# Altium schematic sheet Sch_mcu_brd_mcu.SchDoc
size A
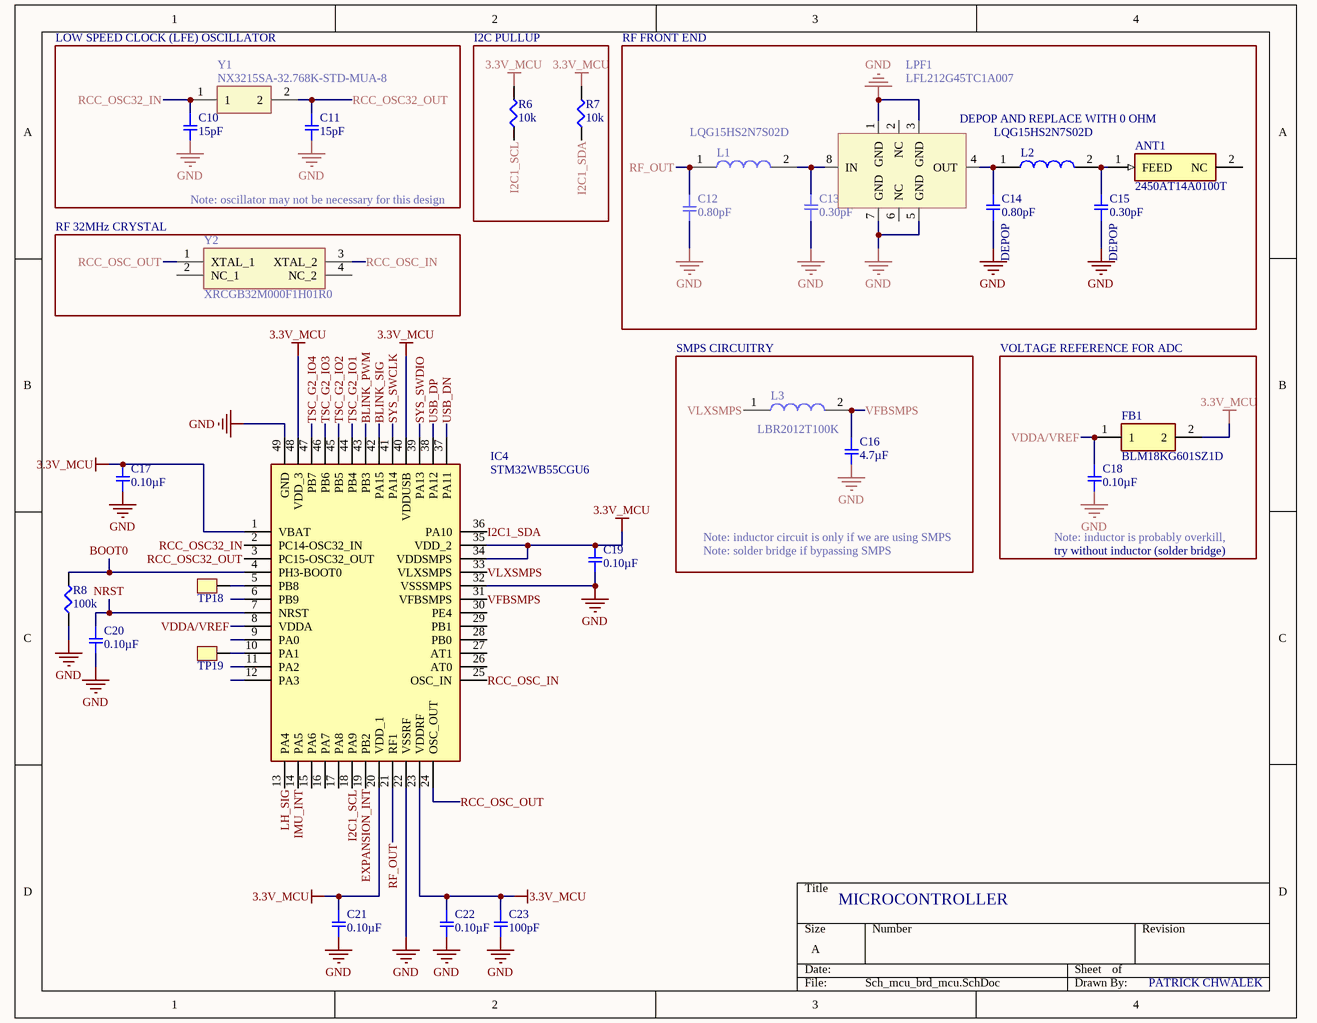
[diagram p0: Sch_mcu_brd_mcu.SchDoc]

## Parts
ANT1  2450AT14A0100T  [ANTC1608X40N]
C10  15pF  [SMD-0402C]
C11  15pF  [SMD-0402C]
C12  0.80pF  [SMD-0402C]
C13  0.30pF  [SMD-0402C]
C14  0.80pF  [SMD-0402C]
C15  0.30pF  [SMD-0402C]
C16  4.7µF  [SMD-0402C]
C17  0.10µF  [SMD-0402C]
C18  0.10µF  [SMD-0402C]
C19  0.10µF  [SMD-0402C]
C20  0.10µF  [SMD-0402C]
C21  0.10µF  [SMD-0402C]
C22  0.10µF  [SMD-0402C]
C23  100pF  [SMD-0402C]
FB1  BLM18KG601SZ1D  [BEADC1608X95N]
IC4  STM32WB55CGU6  [QFN50P700X700X65-49N-D]
L1  LQG15HS2N7S02D  [INDC1005X55N]
L2  LQG15HS2N7S02D  [INDC1005X55N]
L3  LBR2012T100K  [INDC2012X145N]
LPF1  LFL212G45TC1A007  [LFL212G45TC1A007]
R6  10k  [SMD-0402-RES]
R7  10k  [SMD-0402-RES]
R8  100k  [SMD-0402-RES]
TP18  TestPoint  [TestPoint_0.4mm]  (value not drawn)
TP19  TestPoint  [TestPoint_0.4mm]  (value not drawn)
Y1  NX3215SA-32.768K-STD-MUA-8  [NX3215SA]
Y2  XRCGB32M000F1H01R0  [XRCGB32M000F1H01R0]

## Blocks framed on the sheet
I2C PULLUP: R6 R7
RF 32MHz CRYSTAL: Y2

## Nets
3.3V_MCU: C17.1 C19.1 C21.1 C22.1 C23.1 FB1.2 IC4.1(VBAT) IC4.20(VDD_1) IC4.23(VDDRF) IC4.34(VDDSMPS) IC4.35(VDD_2) IC4.40(VDDUSB) IC4.48(VDD_3) R6.2 R7.2
GND: C10.2 C11.2 C12.2 C13.1 C14.1 C15.1 C16.2 C17.2 C18.2 C19.2 C20.2 C21.2 C22.2 C23.2 IC4.22(VSSRF) IC4.32(VSSSMPS) IC4.49(GND) LPF1.1(GND) LPF1.3(GND) LPF1.5(GND) LPF1.7(GND) R8.1
BLINK_PWM: IC4.43(PB3)
BLINK_SIG: IC4.42(PA15)
BOOT0: IC4.4(PH3-BOOT0) R8.2
EXPANSION_INT: IC4.19(PB2)
I2C1_SCL: IC4.18(PA9) R6.1
I2C1_SDA: IC4.36(PA10) R7.1
IMU_INT: IC4.14(PA5)
LH_SIG: IC4.13(PA4)
NRST: C20.1 IC4.7(NRST)
RCC_OSC32_IN: C10.1 IC4.2(PC14-OSC32_IN) Y1.1
RCC_OSC32_OUT: C11.1 IC4.3(PC15-OSC32_OUT) Y1.2
RCC_OSC_IN: IC4.25(OSC_IN) Y2.3(XTAL_2)
RCC_OSC_OUT: IC4.24(OSC_OUT) Y2.1(XTAL_1)
RF_OUT: C12.1 IC4.21(RF1) L1.1
SYS_SWCLK: IC4.41(PA14)
SYS_SWDIO: IC4.39(PA13)
TSC_G2_IO1: IC4.44(PB4)
TSC_G2_IO2: IC4.45(PB5)
TSC_G2_IO3: IC4.46(PB6)
TSC_G2_IO4: IC4.47(PB7)
USB_DN: IC4.37(PA11)
USB_DP: IC4.38(PA12)
VDDA/VREF: C18.1 FB1.1 IC4.8(VDDA)
VFBSMPS: C16.1 IC4.31(VFBSMPS) L3.2
VLXSMPS: IC4.33(VLXSMPS) L3.1
NetANT1_1: ANT1.1(FEED) C15.2 L2.2
NetC13_2: C13.2 L1.2 LPF1.8(IN)
NetC14_2: C14.2 L2.1 LPF1.4(OUT)
NetIC4_5: IC4.5(PB8) TP18.1
NetIC4_10: IC4.10(PA1) TP19.1

Not connected (* = marked no-connect by the designer): ANT1 2(NC); IC4 6(PB9) 9(PA0) 11(PA2) 12(PA3) 15(PA6) 16(PA7) 17(PA8) 26(AT0) 27(AT1) 28(PB0) 29(PB1) 30(PE4); LPF1 2(NC) 6(NC); Y2 2(NC_1) 4(NC_2)

## Notes on the sheet
- LOW SPEED CLOCK (LFE) OSCILLATOR
- RF FRONT END
- (near LPF1) DEPOP AND REPLACE WITH 0 OHM
- Note: oscillator may not be necessary for this design
- (near C14) DEPOP
- (near C15) DEPOP
- SMPS CIRCUITRY
- VOLTAGE REFERENCE FOR ADC
- Note: inductor circuit is only if we are using SMPS
- Note: solder bridge if bypassing SMPS
- (near C18) Note: inductor is probably overkill,
- try without inductor (solder bridge)
- MICROCONTROLLER
- PATRICK CHWALEK

## Library data of the parts
ANT1 = 2450AT14A0100T: Antenna; Manufacturer_Name: JOHANSON TECHNOLOGY; Datasheet Link: https://www.johansontechnology.com/datasheets/2450AT14A0100/2450AT14A0100.pdf; Height: 0.4mm; Manufacturer_Part_Number: 2450AT14A0100T; Mouser Part Number: 609-2450AT14A0100T; Mouser Price/Stock: https://www.mouser.com/Search/Refine.aspx?Keyword=609-2450AT14A0100T
C10 C11 = GCM1555C1H150JA16D: CAP CER 15PF 50V NP0 0402; Manufacturer: Murata Electronics North America; Factory Stock: 0; Unit Price (USD): 0.1; Minimum Quantity: 1; Tolerance: ±5%; Temperature Coefficient: C0G, NP0; Datasheets: http://www.murata.com/~/media/webrenewal/support/library/catalog/products/capacitor/mlcc/c03e.ashx; Image: //media.digikey.com/Renders/Murata%20Renders/ZRB-SERIES-0402.jpg; Digi-Key Part Number: 490-11147-1-ND; Part Number: GCM1555C1H150JA16D; Quantity Available: 6185; @ qty: 0; Packaging: Cut Tape (CT); Series: GCM; Part Status: Active; Value: 15pF; Voltage: 50V; Operating Temperature: -55°C ~ 125°C; Features: -; Ratings: AEC-Q200; Applications: Automotive; Mounting Type: Surface Mount, MLCC; Package / Case: 0402 (1005 Metric); Size / Dimension: 0.039" L x 0.020" W (1.00mm x 0.50mm); Height - Seated (Max): -; Thickness (Max): 0.022" (0.55mm); Lead Spacing: -; Lead Style: -
C12 C14 = GRM1555C1HR80BA01D: CAP CER 0.8PF 50V NP0 0402; Manufacturer: Murata Electronics North America; Factory Stock: 0; Unit Price (USD): 0.1; Minimum Quantity: 1; Tolerance: ±0.1pF; Temperature Coefficient: C0G, NP0; Datasheets: http://www.murata.com/~/media/webrenewal/support/library/catalog/products/capacitor/mlcc/c02e.pdf; Image: //media.digikey.com/Renders/Murata%20Renders/ZRB-SERIES-0402.jpg; Digi-Key Part Number: 490-6269-1-ND; Part Number: GRM1555C1HR80BA01D; Quantity Available: 38847; @ qty: 0; Packaging: Cut Tape (CT); Series: GRM; Part Status: Active; Value: 0.80pF; Voltage: 50V; Operating Temperature: -55°C ~ 125°C; Features: -; Ratings: -; Applications: General Purpose; Mounting Type: Surface Mount, MLCC; Package / Case: 0402 (1005 Metric); Size / Dimension: 0.039" L x 0.020" W (1.00mm x 0.50mm); Height - Seated (Max): -; Thickness (Max): 0.022" (0.55mm); Lead Spacing: -; Lead Style: -
C13 C15 = GRM1555C1HR30WA01D: CAP CER 0.3PF 50V NP0 0402; Manufacturer: Murata Electronics North America; Factory Stock: 0; Unit Price (USD): 0.16; Minimum Quantity: 1; Tolerance: ±0.05pF; Temperature Coefficient: C0G, NP0; Datasheets: http://www.murata.com/~/media/webrenewal/support/library/catalog/products/capacitor/mlcc/c02e.pdf; Image: //media.digikey.com/Renders/Murata%20Renders/ZRB-SERIES-0402.jpg; Digi-Key Part Number: 490-6261-1-ND; Part Number: GRM1555C1HR30WA01D; Quantity Available: 61475; @ qty: 0; Packaging: Cut Tape (CT); Series: GRM; Part Status: Active; Value: 0.30pF; Voltage: 50V; Operating Temperature: -55°C ~ 125°C; Features: -; Ratings: -; Applications: General Purpose; Mounting Type: Surface Mount, MLCC; Package / Case: 0402 (1005 Metric); Size / Dimension: 0.039" L x 0.020" W (1.00mm x 0.50mm); Height - Seated (Max): -; Thickness (Max): 0.022" (0.55mm); Lead Spacing: -; Lead Style: -
C16 = GRM153R60G475ME15D: CAP CER 4.7UF 4V X5R 0402; Manufacturer: Murata Electronics North America; Factory Stock: 0; Unit Price (USD): 0.27; Minimum Quantity: 1; Tolerance: ±20%; Datasheets: http://psearch.en.murata.com/capacitor/product/GRM153R60G475ME15%23.pdf; Image: //media.digikey.com/Renders/Murata%20Renders/ZRB-SERIES-0402.jpg; Digi-Key Part Number: 490-13231-1-ND; Part Number: GRM153R60G475ME15D; Quantity Available: 9100; @ qty: 0; Packaging: Cut Tape (CT); Series: GRM; Part Status: Active; Value: 4.7µF; Voltage: 4V; Temperature Coefficient: X5R; Operating Temperature: -55°C ~ 85°C; Features: -; Ratings: -; Applications: General Purpose; Mounting Type: Surface Mount, MLCC; Package / Case: 0402 (1005 Metric); Size / Dimension: 0.039" L x 0.020" W (1.00mm x 0.50mm); Height - Seated (Max): -; Thickness (Max): 0.013" (0.33mm); Lead Spacing: -; Lead Style: -
C17-C22 = GCM155R71C104KA55D: CAP CER 0.1UF 16V X7R 0402; Manufacturer: Murata Electronics North America; Factory Stock: 0; Unit Price (USD): 0.1; Minimum Quantity: 1; Tolerance: ±10%; Datasheets: http://www.murata.com/~/media/webrenewal/support/library/catalog/products/capacitor/mlcc/c03e.ashx; Image: //media.digikey.com/Renders/Murata%20Renders/ZRB-SERIES-0402.jpg; Digi-Key Part Number: 490-4759-1-ND; Part Number: GCM155R71C104KA55D; Quantity Available: 734194; @ qty: 0; Packaging: Cut Tape (CT); Series: GCM; Part Status: Active; Value: 0.10µF; Voltage: 16V; Temperature Coefficient: X7R; Operating Temperature: -55°C ~ 125°C; Features: -; Ratings: AEC-Q200; Applications: Automotive; Mounting Type: Surface Mount, MLCC; Package / Case: 0402 (1005 Metric); Size / Dimension: 0.039" L x 0.020" W (1.00mm x 0.50mm); Height - Seated (Max): -; Thickness (Max): 0.022" (0.55mm); Lead Spacing: -; Lead Style: -
C23 = GCM1555C1H101JA16D: CAP CER 100PF 50V NP0 0402; Manufacturer: Murata Electronics North America; Factory Stock: 0; Unit Price (USD): 0.1; Minimum Quantity: 1; Tolerance: ±5%; Temperature Coefficient: C0G, NP0; Datasheets: http://www.murata.com/~/media/webrenewal/support/library/catalog/products/capacitor/mlcc/c03e.ashx; Image: //media.digikey.com/Renders/Murata%20Renders/ZRB-SERIES-0402.jpg; Digi-Key Part Number: 490-10669-1-ND; Part Number: GCM1555C1H101JA16D; Quantity Available: 61397; @ qty: 0; Packaging: Cut Tape (CT); Series: GCM; Part Status: Active; Value: 100pF; Voltage: 50V; Operating Temperature: -55°C ~ 125°C; Features: -; Ratings: AEC-Q200; Applications: Automotive; Mounting Type: Surface Mount, MLCC; Package / Case: 0402 (1005 Metric); Size / Dimension: 0.039" L x 0.020" W (1.00mm x 0.50mm); Height - Seated (Max): -; Thickness (Max): 0.022" (0.55mm); Lead Spacing: -; Lead Style: -
FB1 = BLM18KG601SZ1D: Ferrite Bead; Manufacturer_Name: Murata Electronics; Datasheet Link: http://www.murata.com/~/media/webrenewal/support/library/catalog/products/emc/emifil/c31e.ashx?la=en-gb; Height: 0.95mm; Manufacturer_Part_Number: BLM18KG601SZ1D; Mouser Part Number: 81-BLM18KG601SZ1D; Mouser Price/Stock: https://www.mouser.com/Search/Refine.aspx?Keyword=81-BLM18KG601SZ1D
IC4 = STM32WB55CGU6: Integrated Circuit; Manufacturer_Name: STMicroelectronics; Datasheet Link: https://www.st.com/en/microcontrollers/stm32wb55cg.html; Height: 0.65mm; Manufacturer_Part_Number: STM32WB55CGU6; Mouser Part Number: 511-STM32WB55CGU6; Mouser Price/Stock: https://www.mouser.com/Search/Refine.aspx?Keyword=511-STM32WB55CGU6
L1 L2 = LQG15HS2N7S02D: Inductor; Manufacturer_Name: Murata Electronics; Datasheet Link: https://www.arrow.com/en/products/lqg15hs2n7s02d/murata-manufacturing; Height: 0.55mm; Manufacturer_Part_Number: LQG15HS2N7S02D
L3 = LBR2012T100K: Inductor; Manufacturer_Name: TAIYO YUDEN; Datasheet Link: https://componentsearchengine.com/Datasheets/2/LBR2012T100K.pdf; Height: 1.45mm; Manufacturer_Part_Number: LBR2012T100K; Mouser Part Number: 963-LBR2012T100K; Mouser Price/Stock: https://www.mouser.com/Search/Refine.aspx?Keyword=963-LBR2012T100K
R6 R7 = ERJ-2GEJ103X: RES SMD 10K OHM 5% 1/10W 0402; Manufacturer: Panasonic Electronic Components; Factory Stock: 0; Unit Price (USD): 0.00350; @ qty: 1500; Minimum Quantity: 1; Power (Watts): 0.1W, 1/10W; Temperature Coefficient: ±200ppm/°C; Part Number: ERJ-2GEJ103X; Datasheets: http://industrial.panasonic.com/www-cgi/jvcr13pz.cgi?E+PZ+3+AOA0001+ERJ2GEJ103X+7+WW; Image: //media.digikey.com/Photos/Panasonic%20Photos/ERJ-PA2-Series.jpg; Digi-Key Part Number: P10KJCT-ND; Quantity Available: 2560215; Packaging: Cut Tape (CT); Series: ERJ; Part Status: Active; Value: 10k; Tolerance: ±5%; Composition: Thick Film; Features: Automotive AEC-Q200; Operating Temperature: -55°C ~ 155°C; Package / Case: 0402 (1005 Metric); Supplier Device Package: 0402; Size / Dimension: 0.039" L x 0.020" W (1.00mm x 0.50mm); Height - Seated (Max): 0.016" (0.40mm); Number of Terminations: 2; Failure Rate: -
R8 = ERJ-2RKF1003X: RES SMD 100K OHM 1% 1/10W 0402; Manufacturer: Panasonic Electronic Components; Factory Stock: 0; Unit Price (USD): 0.00496; @ qty: 1500; Minimum Quantity: 1; Power (Watts): 0.1W, 1/10W; Temperature Coefficient: ±100ppm/°C; Part Number: ERJ-2RKF1003X; Datasheets: http://industrial.panasonic.com/www-cgi/jvcr13pz.cgi?E+PZ+3+AOA0002+ERJ2RKF1003X+7+WW; Image: //media.digikey.com/Photos/Panasonic%20Photos/ERJ-PA2-Series.jpg; Digi-Key Part Number: P100KLCT-ND; Quantity Available: 2645965; Packaging: Cut Tape (CT); Series: ERJ; Part Status: Active; Value: 100k; Tolerance: ±1%; Composition: Thick Film; Features: Automotive AEC-Q200; Operating Temperature: -55°C ~ 155°C; Package / Case: 0402 (1005 Metric); Supplier Device Package: 0402; Size / Dimension: 0.039" L x 0.020" W (1.00mm x 0.50mm); Height - Seated (Max): 0.016" (0.40mm); Number of Terminations: 2; Failure Rate: -
Y1 = NX3215SA-32.768K-STD-MUA-8: Crystal or Oscillator; Manufacturer_Name: NDK; Datasheet Link: http://www.ndk.com/images/products/catalog/c_NX3215SA-STD-MUA-14_e.pdf; Manufacturer_Part_Number: NX3215SA-32.768K-STD-MUA-8; Mouser Part Number: 344-NX3215SA32768K8; Mouser Price/Stock: https://www.mouser.com/Search/Refine.aspx?Keyword=344-NX3215SA32768K8
Y2 = XRCGB32M000F1H01R0: Crystal or Oscillator; Manufacturer_Name: Murata Electronics; Datasheet Link: https://www.murata.com/en-eu/products/productdetail?partno=XRCGB32M000F1H01R0; Height: 0.7mm; Manufacturer_Part_Number: XRCGB32M000F1H01R0; Mouser Part Number: 81-XRCGB32M000F1H01R; Mouser Price/Stock: https://www.mouser.com/Search/Refine.aspx?Keyword=81-XRCGB32M000F1H01R